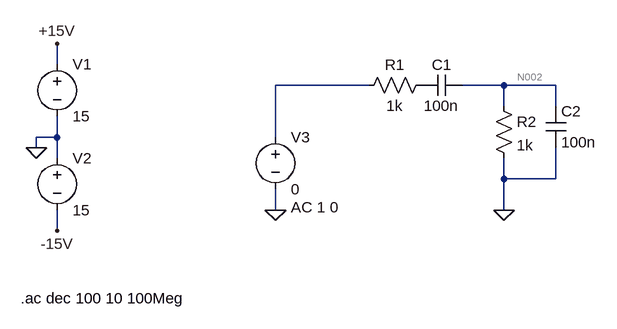
[diagram p0: schematic ex1.asc]
ex1.asc, the LTspice schematic file:
Version 4
SHEET 1 880 680
WIRE -256 -16 -256 -48
WIRE 224 16 80 16
WIRE 432 16 368 16
WIRE 512 16 432 16
WIRE 432 48 432 16
WIRE 512 48 512 16
WIRE -256 96 -256 64
WIRE -256 96 -288 96
WIRE 80 96 80 16
WIRE -288 112 -288 96
WIRE -256 128 -256 96
WIRE 432 160 432 128
WIRE 512 160 512 112
WIRE 512 160 432 160
WIRE 80 208 80 176
WIRE 432 208 432 160
WIRE -256 240 -256 208
FLAG -288 112 0
FLAG -256 -48 +15V
FLAG -256 240 -15V
FLAG 80 208 0
FLAG 432 208 0
SYMBOL voltage -256 -32 R0
WINDOW 123 0 0 Left 0
WINDOW 39 0 0 Left 0
SYMATTR InstName V1
SYMATTR Value 15
SYMBOL voltage -256 112 R0
WINDOW 123 0 0 Left 0
WINDOW 39 0 0 Left 0
SYMATTR InstName V2
SYMATTR Value 15
SYMBOL voltage 80 80 R0
WINDOW 123 24 124 Left 2
WINDOW 39 0 0 Left 0
SYMATTR Value2 AC 1 0
SYMATTR InstName V3
SYMATTR Value 0
SYMBOL res 320 0 R90
WINDOW 0 0 56 VBottom 2
WINDOW 3 32 56 VTop 2
SYMATTR InstName R1
SYMATTR Value 1k
SYMBOL cap 368 0 R90
WINDOW 0 0 32 VBottom 2
WINDOW 3 32 32 VTop 2
SYMATTR InstName C1
SYMATTR Value 100n
SYMBOL res 416 32 R0
SYMATTR InstName R2
SYMATTR Value 1k
SYMBOL cap 496 48 R0
SYMATTR InstName C2
SYMATTR Value 100n
TEXT -312 344 Left 2 !.ac dec 100 10 100Meg

The netlist it stands for:
* ex1.asc
V1 +15V 0 15
V2 0 -15V 15
V3 N001 0 0 AC 1 0
R1 P001 N001 1k
C1 N002 P001 100n
R2 N002 0 1k
C2 N002 0 100n
.ac dec 100 10 100Meg
.backanno
.end

* Results of the author's LTspice run, read from the files saved beside the schematic
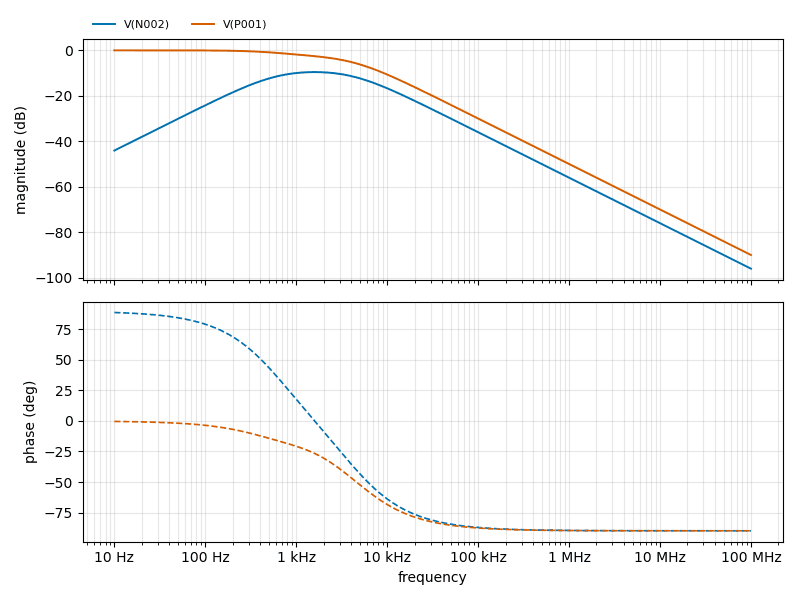
[diagram p1: AC Analysis of ex1.asc, plotted from the saved traces]
* AC Analysis, 1 run:
*   V(N002): -44.04 dB at 10 Hz, -95.96 dB at 100 MHz, peak -9.54 dB at 1.585 kHz, 3 dB below the peak at 481.9 Hz and 5.256 kHz
*   V(P001): -0.00 dB at 10 Hz, -89.94 dB at 100 MHz, peak -0.00 dB at 10 Hz, 3 dB below the peak at 2.025 kHz